# Altium schematic sheet Sheet1.SchDoc
size A2
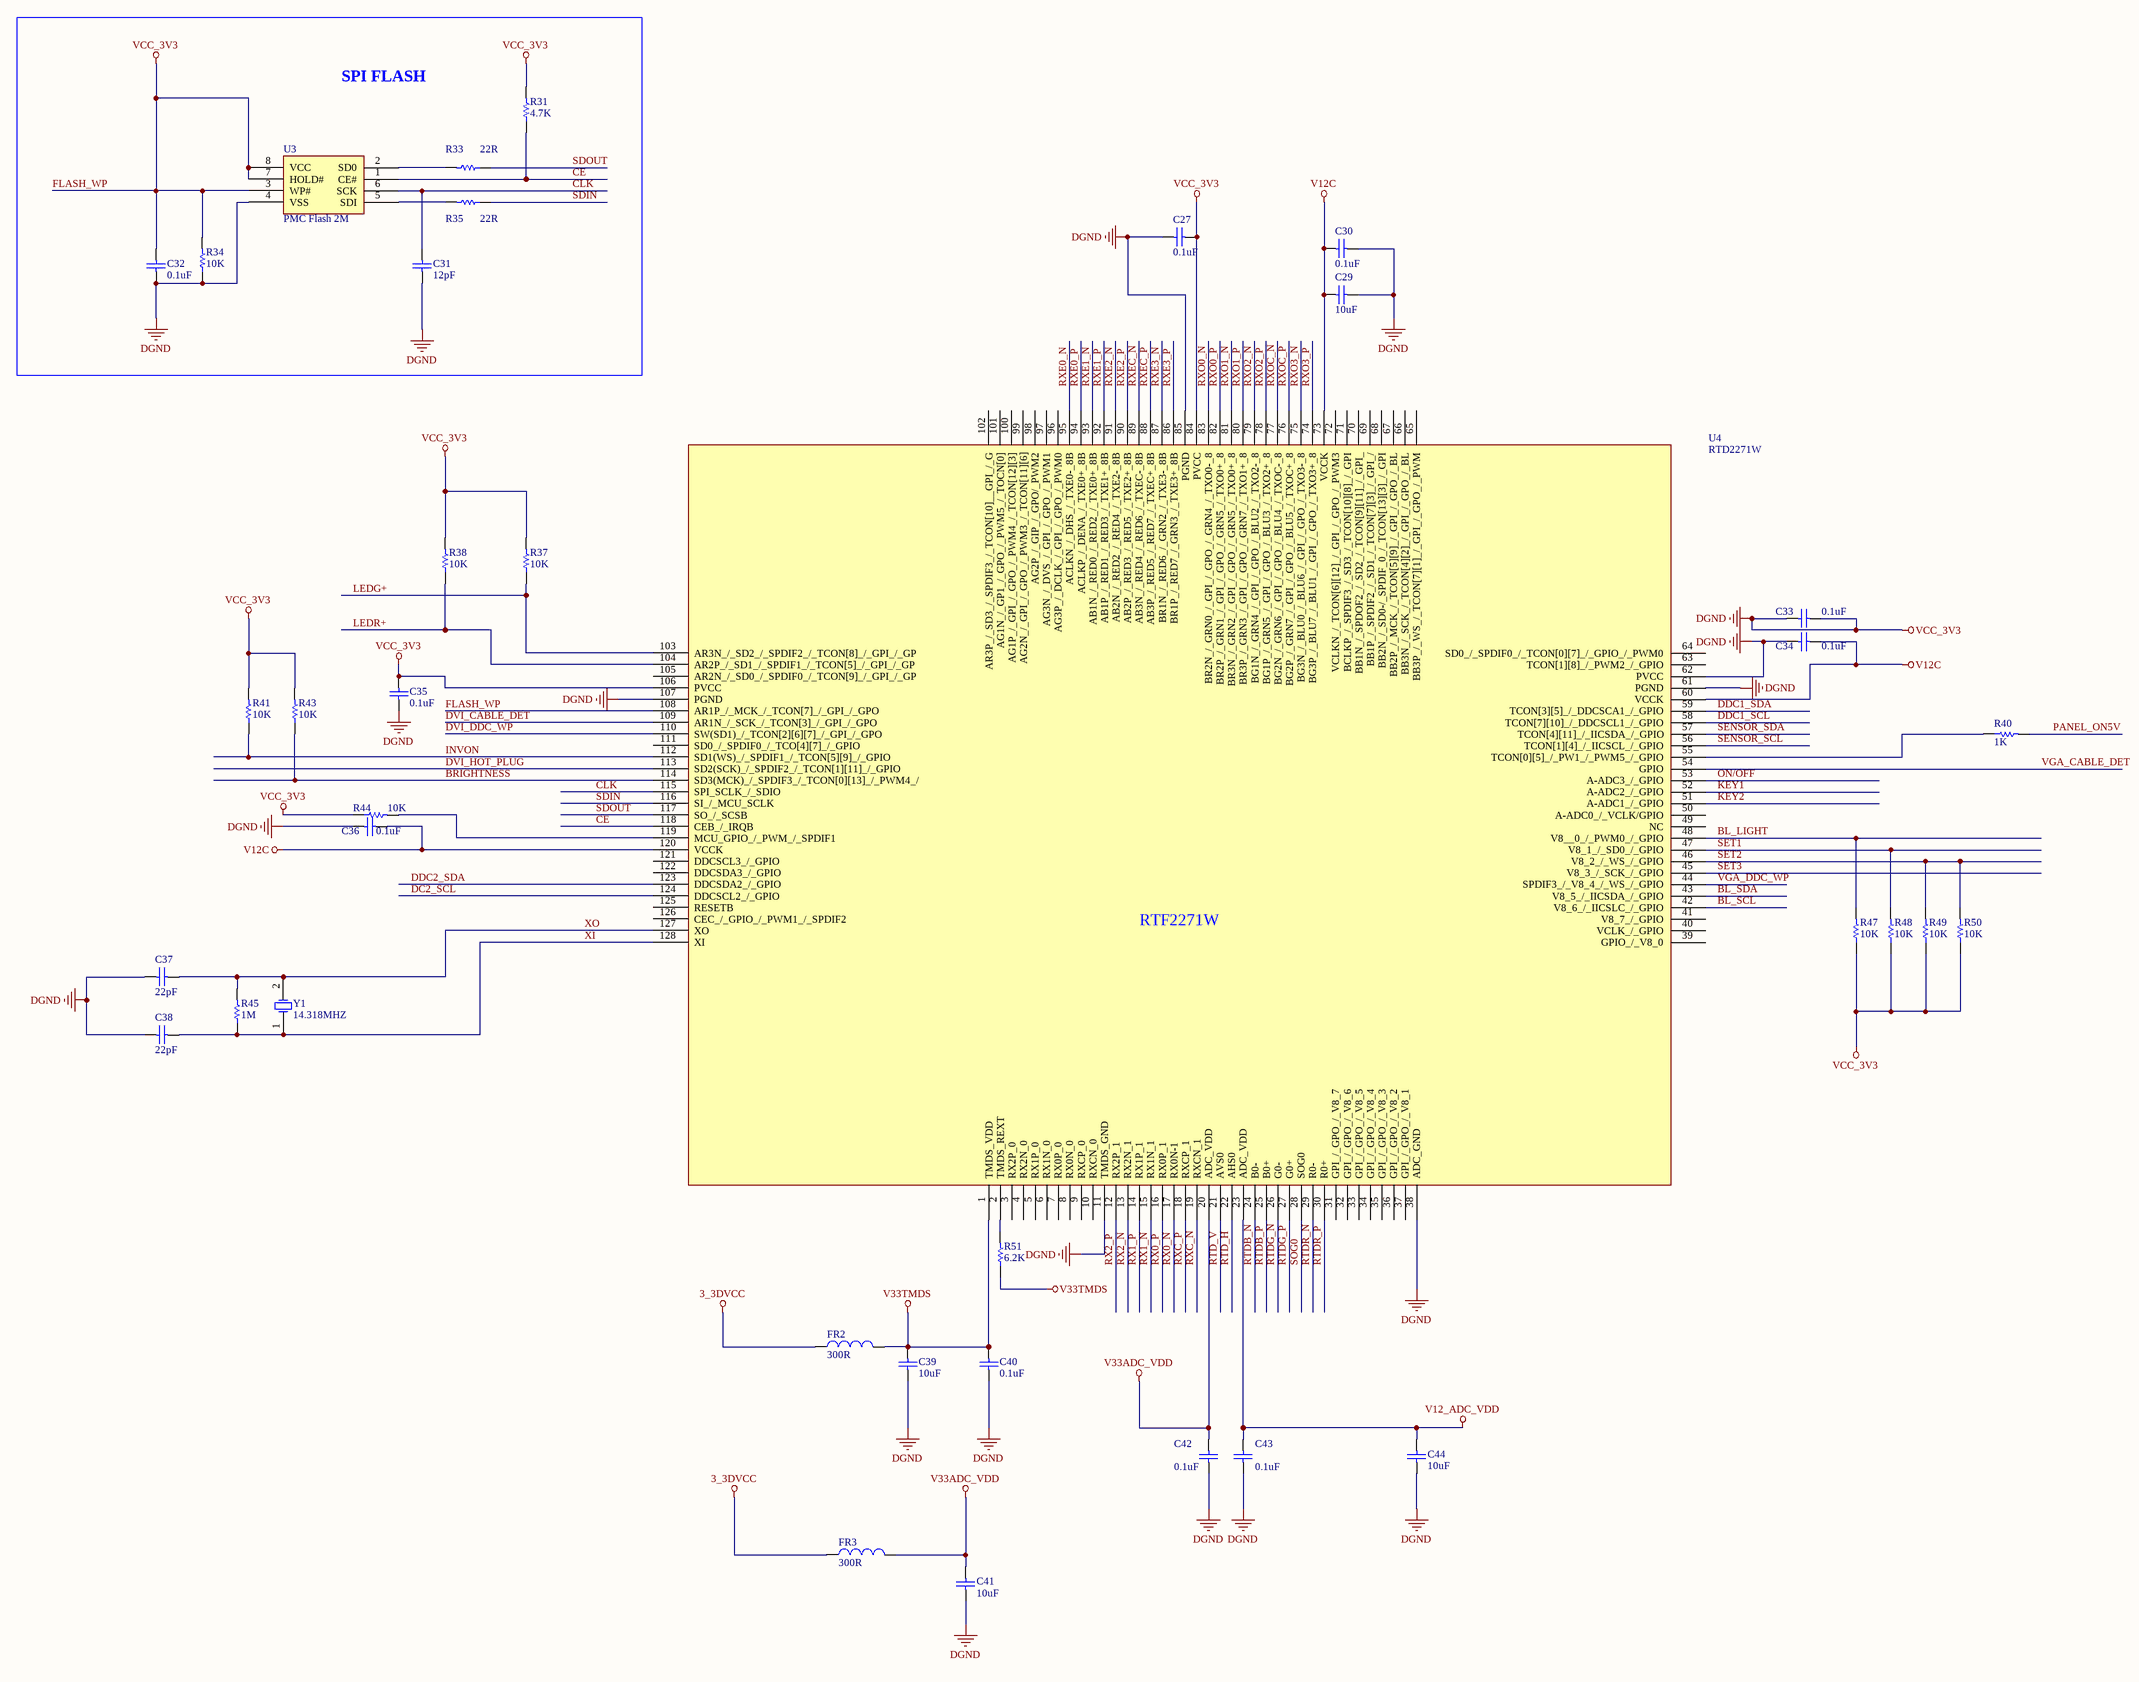
[diagram p0: Sheet1.SchDoc]

## Parts
C27  value 0.1uF  [C-0402]  (hidden comment: Cap)
C29  value 10uF  [C-0402]  (hidden comment: Cap)
C30  value 0.1uF  [C-0402]  (hidden comment: Cap)
C31  value 12pF  [C-0402]  (hidden comment: Cap)
C32  value 0.1uF  [C-0402]  (hidden comment: Cap)
C33  value 0.1uF  [C-0402]  (hidden comment: Cap)
C34  value 0.1uF  [C-0402]  (hidden comment: Cap)
C35  value 0.1uF  [C-0402]  (hidden comment: Cap)
C36  value 0.1uF  [C-0402]  (hidden comment: Cap)
C37  value 22pF  [C-0402]  (hidden comment: Cap)
C38  value 22pF  [C-0402]  (hidden comment: Cap)
C39  value 10uF  [C-0402]  (hidden comment: Cap)
C40  value 0.1uF  [C-0402]  (hidden comment: Cap)
C41  value 10uF  [C-0402]  (hidden comment: Cap)
C42  value 0.1uF  [C-0402]  (hidden comment: Cap)
C43  value 0.1uF  [C-0402]  (hidden comment: Cap)
C44  value 10uF  [C-0402]  (hidden comment: Cap)
FR2  300R  [INDC4532]
FR3  300R  [INDC4532]
R31  value 4.7K  [R-0603]  (hidden comment: Res1)
R33  value 22R  [R-0603]  (hidden comment: Res1)
R34  value 10K  [R-0603]  (hidden comment: Res1)
R35  value 22R  [R-0603]  (hidden comment: Res1)
R37  value 10K  [R-0603]  (hidden comment: Res1)
R38  value 10K  [R-0603]  (hidden comment: Res1)
R40  value 1K  [R-0603]  (hidden comment: Res1)
R41  value 10K  [R-0603]  (hidden comment: Res1)
R43  value 10K  [R-0603]  (hidden comment: Res1)
R44  value 10K  [R-0603]  (hidden comment: Res1)
R45  value 1M  [R-0603]  (hidden comment: Res1)
R47  value 10K  [R-0603]  (hidden comment: Res1)
R48  value 10K  [R-0603]  (hidden comment: Res1)
R49  value 10K  [R-0603]  (hidden comment: Res1)
R50  value 10K  [R-0603]  (hidden comment: Res1)
R51  value 6.2K  [R-0603]  (hidden comment: Res1)
U3  PMC Flash 2M  [U-SOP/1.3]
U4  RTD2271W  [U-QFP128/0.5]
Y1  14.318MHZ  [Y-DH5]

## Blocks framed on the sheet
SPI FLASH: C31 C32 R31 R33-R35 U3

## Nets
3_3DVCC: FR2.1 FR3.1
FLASH_WP: C27.1 C27.2 C29.2 C30.2 C31.1 C32.1 C32.2 C33.1 C33.2 C34.1 C35.1 C35.2 C36.1 C37.1 C38.1 C39.1 C40.1 C41.1 C42.1 C43.1 C44.1 R31.2 R34.1 R34.2 R37.2 R38.2 R41.2 R43.2 R44.1 R47.1 R48.1 R49.1 R50.1 U3.3(WP#) U3.4(VSS) U3.7(HOLD#) U3.8(VCC) U4.11(TMDS_GND) U4.38(ADC_GND) U4.61(PGND) U4.62(PVCC) U4.84(PVCC) U4.85(PGND) U4.106(PVCC) U4.107(PGND) U4.108(AR1P_/_MCK_/_TCON[7]_/_GPI_/_GPO)  [also labelled DGND, VCC_3V3]
V12_ADC_VDD: C43.2 C44.2 U4.23(ADC_VDD)
V12C: C29.1 C30.1 C34.2 C36.2 U4.60(VCCK) U4.73(VCCK) U4.120(VCCK)
V33ADC_VDD: C41.2 C42.2 FR3.2 U4.20(ADC_VDD)
V33TMDS: C39.2 C40.2 FR2.2 R51.1 U4.1(TMDS_VDD)
BL_LIGHT: R47.2 U4.48(V8__0_/_PWM0_/_GPIO)
BL_SCL: U4.42(V8_6_/_IICSLC_/_GPIO)
BL_SDA: U4.43(V8_5_/_IICSDA_/_GPIO)
BRIGHTNESS: R43.1 U4.114(SD3(MCK)_/_SPDIF3_/_TCON[0][13]_/_PWM4_/)
CE: R31.1 U3.1(CE#) U4.118(CEB_/_IRQB)
CLK: C31.2 U3.6(SCK) U4.115(SPI_SCLK_/_SDIO)
DC2_SCL: U4.124(DDCSCL2_/_GPIO)
DDC1_SCL: U4.58(TCON[7][10]_/_DDCSCL1_/_GPIO)
DDC1_SDA: U4.59(TCON[3][5]_/_DDCSCA1_/_GPIO)
DDC2_SDA: U4.123(DDCSDA2_/_GPIO)
DVI_CABLE_DET: U4.109(AR1N_/_SCK_/_TCON[3]_/_GPI_/_GPO)
DVI_DDC_WP: U4.110(SW(SD1)_/_TCON[2][6][7]_/_GPI_/_GPO)
DVI_HOT_PLUG: U4.113(SD2(SCK)_/_SPDIF2_/_TCON[1][11]_/_GPIO)
INVON: R41.1 U4.112(SD1(WS)_/_SPDIF1_/_TCON[5][9]_/_GPIO)
KEY1: U4.52(A-ADC2_/_GPIO)
KEY2: U4.51(A-ADC1_/_GPIO)
LEDG+: R37.1 U4.103(AR3N_/_SD2_/_SPDIF2_/_TCON[8]_/_GPI_/_GP)
LEDR+: R38.1 U4.104(AR2P_/_SD1_/_SPDIF1_/_TCON[5]_/_GPI_/_GP)
ON/OFF: U4.53(A-ADC3_/_GPIO)
PANEL_ON5V: R40.2
RTD_H: U4.22(AHS0)
RTD_V: U4.21(AVS0)
RTDB_N: U4.24(B0-)
RTDB_P: U4.25(B0+)
RTDG_N: U4.26(G0-)
RTDG_P: U4.27(G0+)
RTDR_N: U4.29(R0-)
RTDR_P: U4.30(R0+)
RX0_N: U4.17(RX0N-1)
RX0_P: U4.16(RX0P_1)
RX1_N: U4.15(RX1N_1)
RX1_P: U4.14(RX1P_1)
RX2_N: U4.13(RX2N_1)
RX2_P: U4.12(RX2P_1)
RXC_N: U4.19(RXCN_1)
RXC_P: U4.18(RXCP_1)
RXE0_N: U4.95(ACLKN_/_DHS_/_TXE0-_8B)
RXE0_P: U4.94(ACLKP_/_DENA_/_TXE0+_8B)
RXE1_N: U4.93(AB1N_/_RED0_/_RED2_/_TXE0+_8B)
RXE1_P: U4.92(AB1P_/_RED1_/_RED3_/_TXE1+_8B)
RXE2_N: U4.91(AB2N_/_RED2_/_RED4_/_TXE2-_8B)
RXE2_P: U4.90(AB2P_/_RED3_/_RED5_/_TXE2+_8B)
RXE3_N: U4.87(BR1N_/_RED6_/_GRN2_/_TXE3-_8B)
RXE3_P: U4.86(BR1P_/_RED7_/_GRN3_/_TXE3+_8B)
RXEC_N: U4.89(AB3N_/_RED4_/_RED6_/_TXEC-_8B)
RXEC_P: U4.88(AB3P_/_RED5_/_RED7_/_TXEC+_8B)
RXO0_N: U4.83(BR2N_/_GRN0_/_GPI_/_GPO_/_GRN4_/_TXO0-_8)
RXO0_P: U4.82(BR2P_/_GRN1_/_GPI_/_GPO_/_GRN5_/_TXO0+_8)
RXO1_N: U4.81(BR3N_/_GRN2_/_GPI_/_GPO_/_GRN5_/_TXO0+_8)
RXO1_P: U4.80(BR3P_/_GRN3_/_GPI_/_GPO_/_GRN7_/_TXO1+_8)
RXO2_N: U4.79(BG1N_/_GRN4_/_GPI_/_GPO_/_BLU2_/_TXO2-_8)
RXO2_P: U4.78(BG1P_/_GRN5_/_GPI_/_GPO_/_BLU3_/_TXO2+_8)
RXO3_N: U4.75(BG3N_/_BLU0_/_BLU6_/_GPI_/_GPO_/_TXO3-_8)
RXO3_P: U4.74(BG3P_/_BLU7_/_BLU1_/_GPI_/_GPO_/_TXO3+_8)
RXOC_N: U4.77(BG2N_/_GRN6_/_GPI_/_GPO_/_BLU4_/_TXOC-_8)
RXOC_P: U4.76(BG2P_/_GRN7_/_GPI_/_GPO_/_BLU5_/_TXOC+_8)
SDIN: R35.1 U4.116(SI_/_MCU_SCLK)
SDOUT: R33.1 U4.117(SO_/_SCSB)
SENSOR_SCL: U4.56(TCON[1][4]_/_IICSCL_/_GPIO)
SENSOR_SDA: U4.57(TCON[4][11]_/_IICSDA_/_GPIO)
SET1: R48.2 U4.47(V8_1_/_SD0_/_GPIO)
SET2: R49.2 R50.2 U4.46(V8_2_/_WS_/_GPIO)
SET3: U4.45(V8_3_/_SCK_/_GPIO)
SOG0: U4.28(SOG0)
VGA_CABLE_DET: U4.54(GPIO)
VGA_DDC_WP: U4.44(SPDIF3_/_V8_4_/_WS_/_GPIO)
XI: C38.2 R45.1 U4.128(XI) Y1.1(OSC1)
XO: C37.2 R45.2 U4.127(XO) Y1.2(OSC2)
NetR33_2: R33.2 U3.2(SD0)
NetR35_2: R35.2 U3.5(SDI)
NetR40_1: R40.1 U4.55(TCON[0][5]_/_PW1_/_PWM5_/_GPIO)
NetR44_2: R44.2 U4.119(MCU_GPIO_/_PWM_/_SPDIF1)
NetR51_2: R51.2 U4.2(TMDS_REXT)

Not connected (* = marked no-connect by the designer): U4 3(RX2P_0) 4(RX2N_0) 5(RX1P_0) 6(RX1N_0) 7(RX0P_0) 8(RX0N_0) 9(RXCP_0) 10(RXCN_0) 31(GPI_/_GPO_/_V8_7) 32(GPI_/_GPO_/_V8_6) 33(GPI_/_GPO_/_V8_5) 34(GPI_/_GPO_/_V8_4) 35(GPI_/_GPO_/_V8_3) 36(GPI_/_GPO_/_V8_2) 37(GPI_/_GPO_/_V8_1) 39(GPIO_/_V8_0) 40(VCLK_/_GPIO) 41(V8_7_/_GPIO) 49(NC) 50(A-ADC0_/_VCLK/GPIO) 63(TCON[1][8]_/_PWM2_/_GPIO) 64(SD0_/_SPDIF0_/_TCON[0][7]_/_GPIO_/_PWM0) 65(BB3P_/_WS_/_TCON[7][1]_/_GPI_/_GPO_/_PWM) 66(BB3N_/_SCK_/_TCON[4][2]_/_GPI_/_GPO_/_BL) 67(BB2P_/_MCK_/_TCON[5][9]_/_GPI_/_GPO_/_BL) 68(BB2N_/_SD0-/_SPDIF_0_/_TCON[13][3]_/_GPI) 69(BB1P_/_SPDIF2_/_SD1_/_TCON[7][3]_/_GPI_/) 70(BB1N_/_SPDOF2_/_SD2_/_TCON[9][11]_/_GPI_) 71(BCLKP_/_SPDIF3_/_SD3_/_TCON[10][8]_/_GPI) 72(VCLKN_/_TCON[6][12]_/_GPI_/_GPO_/_PWM3) 96(AG3P_/_DCLK_/_GPI_/_GPO_/_PWM0) 97(AG3N_/_DVS_/_GPI_/_GPO_/_PWM1) 98(AG2P_/_GIP_/_GPO/_PWM2) 99(AG2N_/_GPI_/_GPO_/_PWM3_/_TCON[11][6]) 100(AG1P_/_GPI_/_GPO_/_PWM4_/_TCON[12][3]) 101(AG1N_/_GP1_/_GPO_/_PWM5_/_TOCN[0]) 102(AR3P_/_SD3_/_SPDIF3_/_TCON[10]__GPI_/_G) 105(AR2N_/_SD0_/_SPDIF0_/_TCON[9]_/_GPI_/_GP) 111(SD0_/_SPDIF0_/_TCO[4][7]_/_GPIO) 121(DDCSCL3_/_GPIO) 122(DDCSDA3_/_GPIO) 125(RESETB) 126(CEC_/_GPIO_/_PWM1_/_SPDIF2)

## Notes on the sheet
- (in symbol RTD2271W) RTF2271W

## Library data of the parts
C27 C29-C44 = Cap: Capacitor; Published: 8-Jun-2000; LatestRevisionDate: 17-Jul-2002; LatestRevisionNote: Re-released for DXP Platform.; PackageReference: RAD-0.3; Publisher: Altium Limited; PackageDescription: Radial Cap, Thru-Hole; 2 Leads; 0.3 in Pin Spacing
FR2 FR3 = Inductor: Code_IEC: 1005; Value: 10mH; Published: 8-Jun-2000; LatestRevisionDate: 29-May-2009; LatestRevisionNote: IPC-7351 Footprint Added.; PackageReference: 0402-A; Publisher: Altium Limited; PackageDescription: Chip Inductor; Code_JEITA: 0402
R31 R33-R35 R37 R38 R40 R41 R43-R45 R47-R51 = Res1: Resistor; Published: 8-Jun-2000; LatestRevisionDate: 17-Jul-2002; LatestRevisionNote: Re-released for DXP Platform.; PackageReference: AXIAL-0.3; Publisher: Altium Limited; PackageDescription: Axial Device, Thru-Hole; 2 Leads; 0.3 in Pin Spacing
U3 = PMC Flash2M
U4 = RTD2271W: 驱动板 主板
Y1 = XTAL: Crystal Oscillator; Published: 8-Jun-2000; LatestRevisionDate: 17-Jul-2002; LatestRevisionNote: Re-released for DXP Platform.; PackageReference: R38; Publisher: Altium Limited; PackageDescription: Crystal, Thru-Hole; 2 Leads; Body 3.1 x 8.2 mm (Dia.xH)